# EAGLE design breakoutBoard_03 (EAGLE 7.2.0)
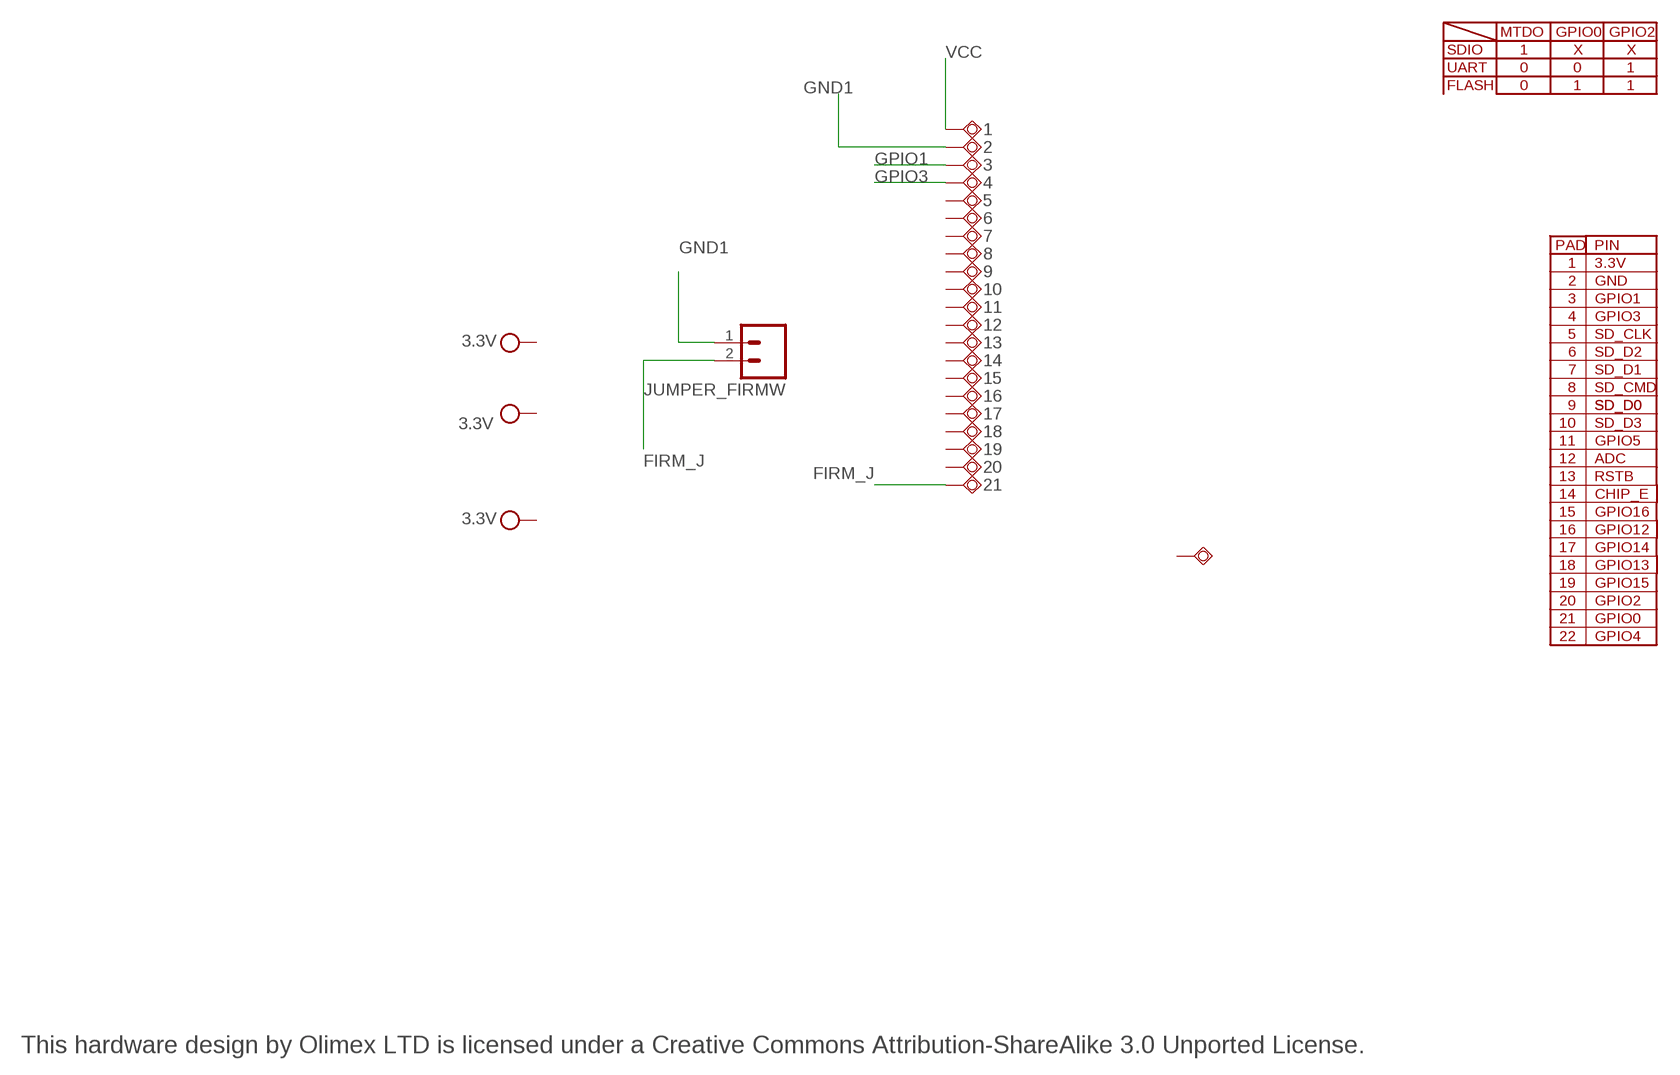
[diagram p0: schematic, sheet 1, part 1 of 2]
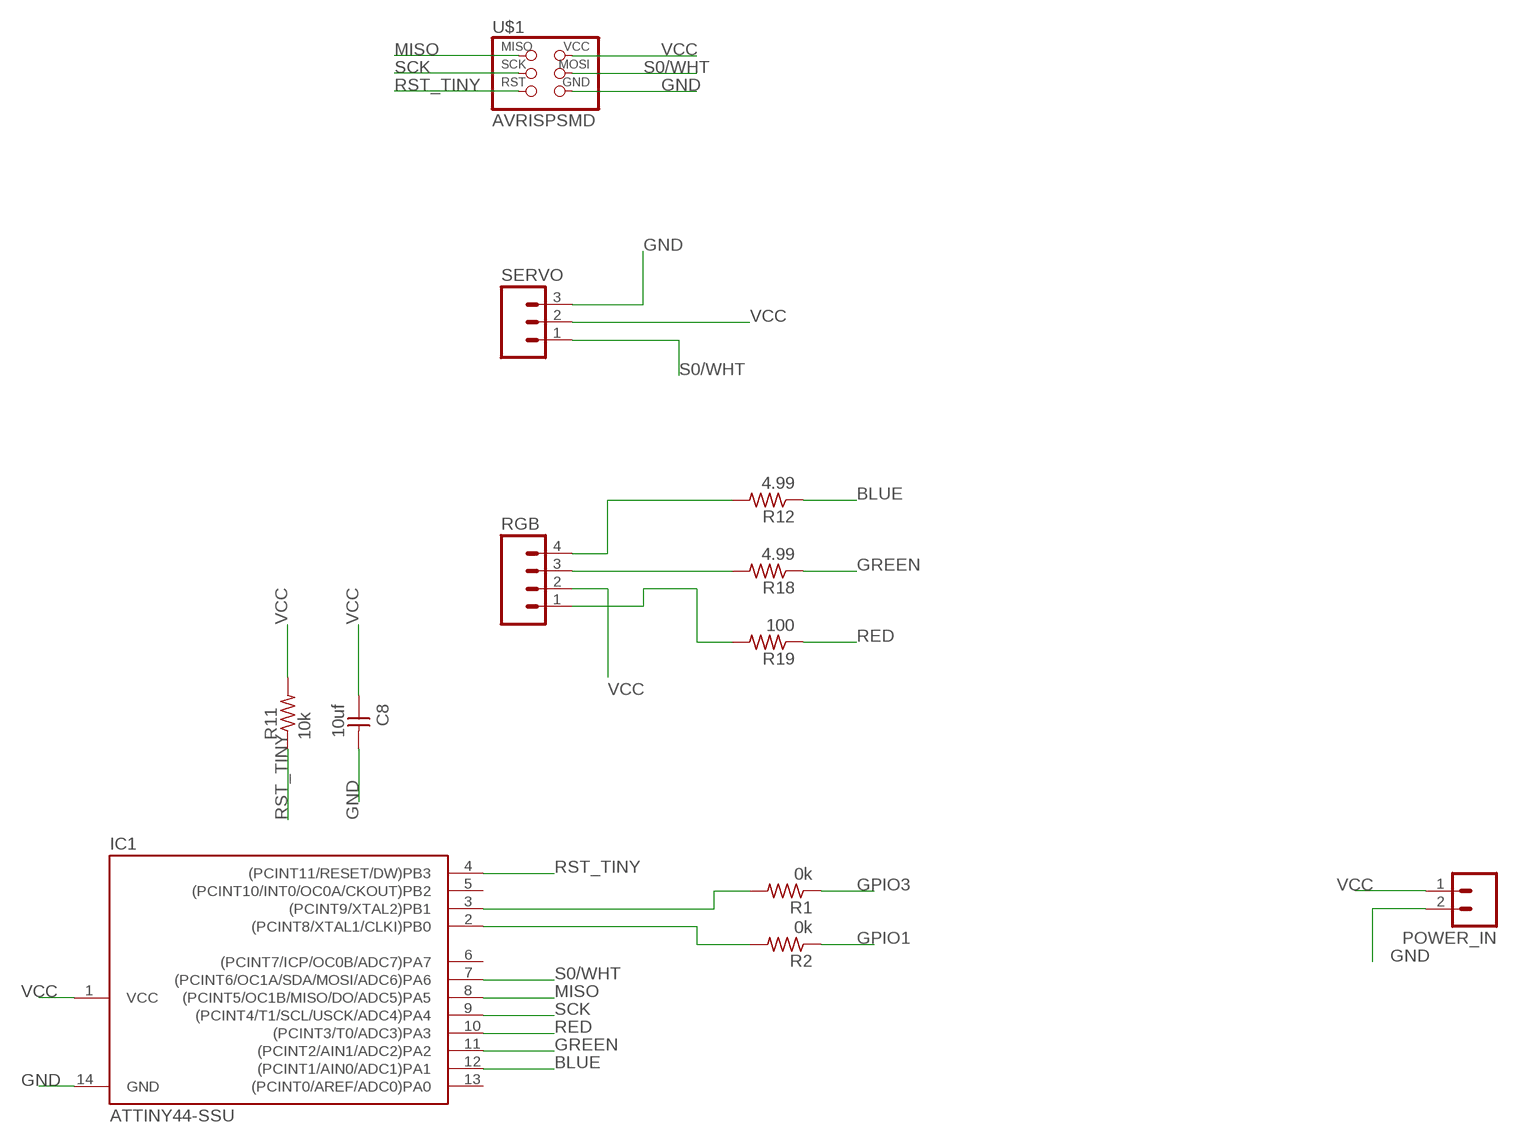
[diagram p1: schematic, sheet 1, part 2 of 2]

## Parts
1  TESTPAD8  [TESTPAD50/80]
2  TESTPAD8  [TESTPAD50/80]
3  TESTPAD8  [TESTPAD50/80]
4  TESTPAD8  [TESTPAD50/80]
5  TESTPAD8  [TESTPAD50/80]
6  TESTPAD8  [TESTPAD50/80]
7  TESTPAD8  [TESTPAD50/80]
8  TESTPAD8  [TESTPAD50/80]
9  TESTPAD8  [TESTPAD50/80]
10  TESTPAD8  [TESTPAD50/80]
11  TESTPAD8  [TESTPAD50/80]
12  TESTPAD8  [TESTPAD50/80]
13  TESTPAD8  [TESTPAD50/80]
14  TESTPAD8  [TESTPAD50/80]
15  TESTPAD8  [TESTPAD50/80]
16  TESTPAD8  [TESTPAD50/80]
17  TESTPAD8  [TESTPAD50/80]
18  TESTPAD8  [TESTPAD50/80]
19  TESTPAD8  [TESTPAD50/80]
20  TESTPAD8  [TESTPAD50/80]
21  TESTPAD8  [TESTPAD50/80]
22  TESTPAD8  [TESTPAD50/80]
C8  10uf  UNPOLARIZED_CAPACITOR1206  [1206]
IC1  ATTINY44-SSU  [SOIC14]
JUMPER_FIRMW  M02LOCK_LONGPADS  [1X02_LOCK_LONGPADS]
POWER_IN  M02LOCK_LONGPADS  [1X02_LOCK_LONGPADS]
R1  0k  RESISTOR1206  [1206]
R2  0k  RESISTOR1206  [1206]
R11  10k  RESISTOR1206  [1206]
R12  4.99  RESISTOR1206  [1206]
R18  4.99  RESISTOR1206  [1206]
R19  100  RESISTOR1206  [1206]
RGB  M04LONGPADS  [1X04_LONGPADS]
SERVO  M03LOCK_LONGPADS  [1X03_LOCK_LONGPADS]
U$1  AVRISPSMD  [2X03SMD]

## Nets
BLUE: IC1.12((PCINT1/AIN0/ADC1)PA1) R12.1
FIRM_J: 21.P$1(PP) JUMPER_FIRMW.2
GND: C8.2 IC1.14(GND) POWER_IN.2 SERVO.3 U$1.6(GND)
GND1: 2.P$1(PP) JUMPER_FIRMW.1
GPIO1: 3.P$1(PP) R2.1
GPIO3: 4.P$1(PP) R1.1
GREEN: IC1.11((PCINT2/AIN1/ADC2)PA2) R18.1
MISO: IC1.8((PCINT5/OC1B/MISO/DO/ADC5)PA5) U$1.1(MISO)
N$1: IC1.3((PCINT9/XTAL2)PB1) R1.2
N$2: IC1.2((PCINT8/XTAL1/CLKI)PB0) R2.2
N$20: R12.2 RGB.4
N$24: R18.2 RGB.3
N$25: R19.2 RGB.1
RED: IC1.10((PCINT3/T0/ADC3)PA3) R19.1
RST_TINY: IC1.4((PCINT11/RESET/DW)PB3) R11.1 U$1.5(RST)
S0/WHT: IC1.7((PCINT6/OC1A/SDA/MOSI/ADC6)PA6) SERVO.1 U$1.4(MOSI)
SCK: IC1.9((PCINT4/T1/SCL/USCK/ADC4)PA4) U$1.3(SCK)
VCC: 1.P$1(PP) C8.1 IC1.1(VCC) POWER_IN.1 R11.2 RGB.2 SERVO.2 U$1.2(VCC)
Unconnected: 5.P$1(PP) 6.P$1(PP) 7.P$1(PP) 8.P$1(PP) 9.P$1(PP) 10.P$1(PP) 11.P$1(PP) 12.P$1(PP) 13.P$1(PP) 14.P$1(PP) 15.P$1(PP) 16.P$1(PP) 17.P$1(PP) 18.P$1(PP) 19.P$1(PP) 20.P$1(PP) 22.P$1(PP) IC1.5((PCINT10/INT0/OC0A/CKOUT)PB2) IC1.6((PCINT7/ICP/OC0B/ADC7)PA7) IC1.13((PCINT0/AREF/ADC0)PA0)

## Notes on the sheet
- MTDO | GPIO0 | GPIO2
- SDIO | 1 | X | X
- UART | 0 | 0 | 1
- FLASH | 0 | 1 | 1
- PAD | PIN
- 1 | 3.3V
- 2 | GND
- 3 | GPIO1
- 4 | GPIO3
- 5 | SD_CLK
- 6 | SD_D2
- 7 | SD_D1
- 8 | SD_CMD
- 9 | SD_D0 | SD_D0
- 10 | SD_D3
- 11 | GPIO5
- 12 | ADC
- 13 | RSTB
- 14 | CHIP_E
- 15 | GPIO16
- 16 | GPIO12
- 17 | GPIO14
- 18 | GPIO13
- 19 | GPIO15
- 20 | GPIO2
- 21 | GPIO0
- 22 | GPIO4
- This hardware design by Olimex LTD is licensed under a Creative Commons Attribution-ShareAlike 3.0 Unported License.

## Library data of the parts
1-22 = gogo:TESTPAD: drill 40mils, diameter 70mils
C8 = 01_FAB_RHello:UNPOLARIZED_CAPACITOR: unpolarized_capacitor
IC1 = 01_FAB_RHello:ATTINY44
JUMPER_FIRMW POWER_IN = SparkFun-Connectors:M02: Standard 2-pin 0.1" header. Use with - straight break away headers ( PRT-00116) - right angle break away headers (PRT-00553) - swiss pins (PRT-00743) - machine pins (PRT-00117) - female headers (PRT-00115) Molex polarized connector foot print use with: PRT-08233 with associated crimp pins and housings. 2.54_SCREWTERM for use with PRT-10571. 3.5mm Screw Terminal footprints for PRT-08084 5mm Screw Terminal footprints for use with PRT-08432
R1 R2 R11 R12 R18 R19 = 01_FAB_RHello:RESISTOR
RGB = SparkFun-Connectors:M04: Header 4 Standard 4-pin 0.1" header. Use with straight break away headers (SKU : PRT-00116), right angle break away headers (PRT-00553), swiss pins (PRT-00743), machine pins (PRT-00117), and female headers (PRT-00115). Molex polarized connector foot print use with SKU : PRT-08231 with associated crimp pins and housings. 1MM SMD Version SKU: PRT-10208
SERVO = SparkFun-Connectors:M03: Header 3 Standard 3-pin 0.1" header. Use with straight break away headers (SKU : PRT-00116), right angle break away headers (PRT-00553), swiss pins (PRT-00743), machine pins (PRT-00117), and female headers (PRT-00115). Molex polarized connector foot print use with SKU : PRT-08232 with associated crimp pins and housings.
U$1 = 01_FAB_RHello:AVRISP

## Board
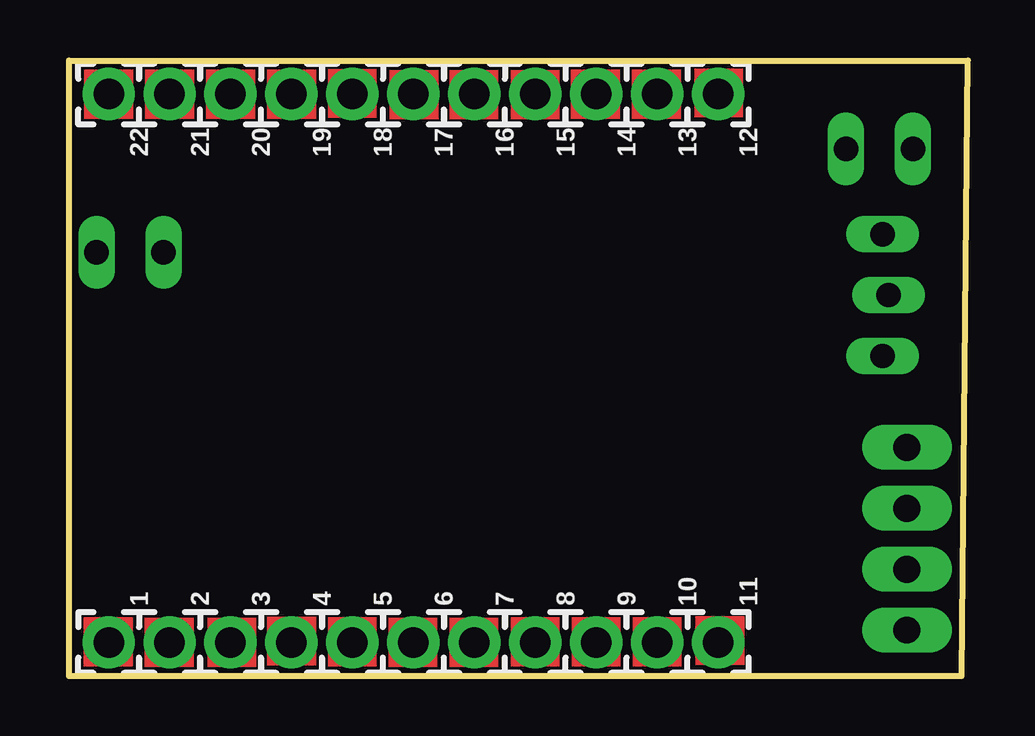
[diagram p2: board, top side]
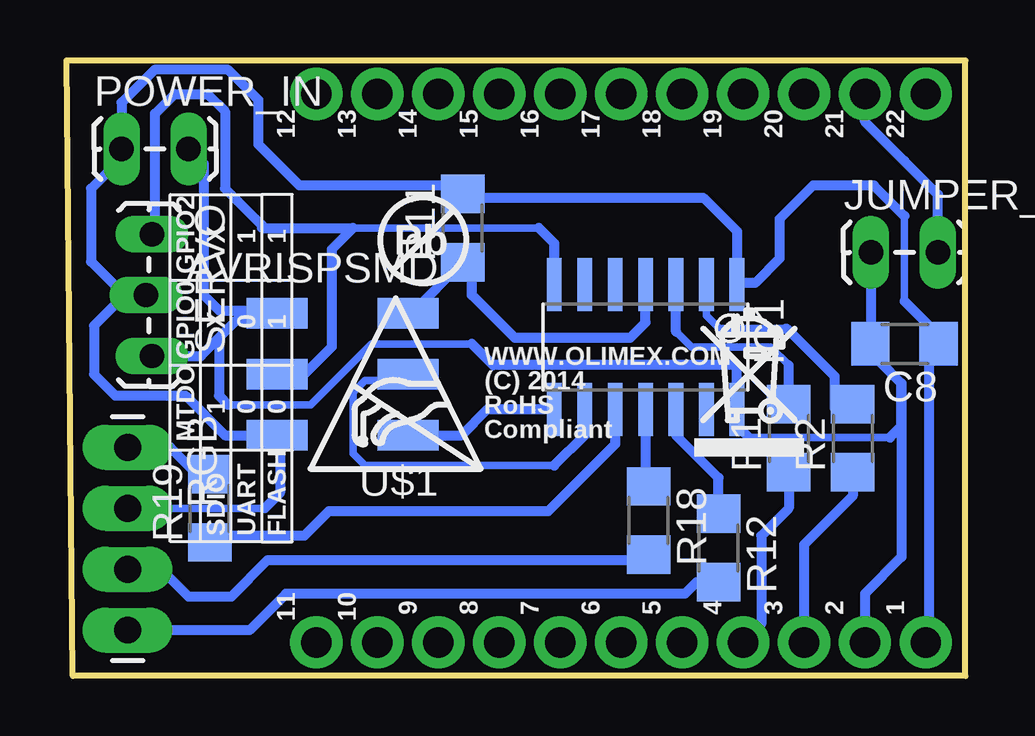
[diagram p3: board, bottom side, seen from below]

Size 37.47 x 25.65 mm. Coordinates in mm from the lower left corner, seen from the top.
Outline: 37.21,0 37.47,25.65 0,25.65 0,0 37.21,0
Copper layers (1+16): Top 0.035mm / dielectric 1.5mm / Bottom 0.035mm
Design rules "default": minimum track width 5mil, minimum drill 0.3mm, track to track 5mil, track to pad 5mil, pad to pad 5mil, via to via 5mil, smd to smd 1mil, copper to edge 5mil, drill to drill 8mil, minimum pad ring 6mil, minimum via ring 6mil, stop-mask expansion 2mil, vias tented up to drill 25mil, thermal gap 10mil
tRestrict: 94 lines
bRestrict: 99 lines

### Footprints (pad centres in the part's own frame; a part is rotated, then mirrored left to right if it is on the bottom)
TESTPAD50/80 = drill 1.27 pad 2.184: P$1 0,0
1206 = smd 1.6 x 1.803: 1 -1.422,0; 2 1.422,0
SOIC14 = smd 0.61 x 2.21: 1 -3.81,-2.603; 2 -2.54,-2.603; 3 -1.27,-2.603; 4 0,-2.603; 5 1.27,-2.603; 6 2.54,-2.603; 7 3.81,-2.603; 8 3.81,2.603; 9 2.54,2.603; 10 1.27,2.603; 11 0,2.603; 12 -1.27,2.603; 13 -2.54,2.603; 14 -3.81,2.603
1X02_LOCK_LONGPADS = drill 1.016 long: 1 -0.127,0; 2 2.667,0
1X04_LONGPADS = drill 1.118 pad 1.88 long: 1 0,0; 2 2.54,0; 3 5.08,0; 4 7.62,0
1X03_LOCK_LONGPADS = drill 1.016 long: 1 0,0; 2 2.54,-0.254; 3 5.08,0
2X03SMD = smd 2.54 x 1.27: 1 -2.54,2.54; 2 2.92,2.54; 3 -2.54,0; 4 2.92,0; 5 -2.54,-2.54; 6 2.92,-2.54

### Placement (x,y rotation side)
1  1.65,1.4 0 top
2  4.19,1.4 0 top
3  6.73,1.4 0 top
4  9.27,1.4 0 top
5  11.81,1.4 180 top
6  14.35,1.4 180 top
7  16.89,1.4 180 top
8  19.43,1.4 180 top
9  21.97,1.4 180 top
10  24.51,1.4 180 top
11  27.05,1.4 0 top
12  27.05,24.26 0 top
13  24.51,24.26 0 top
14  21.97,24.26 0 top
15  19.43,24.26 0 top
16  16.89,24.26 180 top
17  14.35,24.26 0 top
18  11.81,24.26 180 top
19  9.27,24.26 0 top
20  6.73,24.26 180 top
21  4.19,24.26 180 top
22  1.65,24.26 180 top
C8  2.54,13.84 180 bottom
IC1  13.34,13.72 180 bottom
JUMPER_FIRMW  3.81,17.65 0 bottom
POWER_IN  35.05,21.97 0 bottom
R1  7.37,9.91 90 bottom
R2  4.7,9.91 90 bottom
R11  20.96,18.67 90 bottom
R12  10.29,5.33 270 bottom
R18  13.21,6.48 270 bottom
R19  31.5,6.98 90 bottom
RGB  34.92,9.53 270 bottom
SERVO  33.91,18.41 270 bottom
U$1  25.78,12.57 180 bottom
U$4  [ESD_SYMBOL]  27.3,8.64 0 bottom
U$6  [PB_SMALL]  22.61,18.16 180 bottom
U$7  [RECYCLE_BIN1/8]  11.3,9.14 0 bottom

### Tracks (layer width: path | path; a pad name or v marks a point on that pad's centre or on a via)
BLUE
  Bottom 0.406: R12.1 10.29,8.26 12.06,10.03 IC1.12
FIRM_J
  Bottom 0.406: JUMPER_FIRMW.2 1.14,20.07 2.54,21.46 4.19,23.11 21.P$1
GND
  Bottom 0.305: 9.02,9.93 3.15,9.93 | 30.73,11.3 27.3,11.3 24.77,13.84 20.57,13.84
  Bottom 0.406: 3.94,13.87 C8.2 3.56,13.44 3.56,13.08 2.67,12.19 2.67,10.41 3.15,9.93 | 9.02,9.93 9.53,10.44 IC1.14 9.53,12.83 9.65,12.95 19.68,12.95 20.57,13.84 | 31.12,14.1 30.35,14.86 28.45,14.86 U$1.6 28.7,15.24 31.12,15.24 31.75,15.88 31.75,21.34 POWER_IN.2 | 31.12,14.1 31.12,11.68 30.73,11.3 | SERVO.3 31.88,13.34 31.12,14.1
GND1
  Bottom 0.406: JUMPER_FIRMW.1 3.94,13.46 2.67,12.19 2.67,4.95 4.19,3.43 2.P$1
GPIO1
  Bottom 0.406: R2.1 4.7,7.49 6.73,5.46 3.P$1
GPIO3
  Bottom 0.406: R1.1 7.37,6.98 8.51,5.84 8.51,2.16 4.P$1
GREEN
  Bottom 0.406: IC1.11 13.34,8.03 R18.1
MISO
  Bottom 0.406: U$1.1 21.01,10.03 19.91,11.12 17.16,11.12 IC1.8
N$1
  Bottom 0.305: 7.37,12.95 8.13,13.72 11.43,13.72 12.06,14.35
  Bottom 0.406: R1.2 7.37,12.95 | 12.06,14.35 IC1.3
N$2
  Bottom 0.305: IC1.2 10.79,15.02 10.26,14.48 7.49,14.48
  Bottom 0.406: 4.7,11.94 R2.2 4.7,11.18 5.46,11.18 5.46,12.49 7.45,14.48 7.49,14.48
N$20
  Bottom 0.406: R12.2 11.2,3.91 11.68,3.43 28.32,3.43 29.84,1.91 RGB.4
N$24
  Bottom 0.406: R18.2 13.44,4.83 29.08,4.83 30.61,3.3 32.38,3.3 33.53,4.45 RGB.3
N$25
  Bottom 0.406: R19.2 32.03,8.41 33.15,9.53 RGB.1
RED
  Bottom 0.406: IC1.10 14.61,9.65 17.4,6.86 26.54,6.86 27.56,5.84 31.22,5.84 R19.1
RST_TINY
  Bottom 0.406: 21.23,17.53 R11.1 | R11.1 20.96,16.89 | IC1.4 13.34,14.73 13.97,14.1 18.8,14.1 20.57,15.88 20.57,16.87 R11.1 | U$1.5 23.09,15.11 R11.1
S0/WHT
  Bottom 0.305: 25.53,18.67 17.78,18.67
  Bottom 0.406: 27.43,12.7 26.42,13.72 26.42,17.78 25.53,18.67 29.34,18.67 29.34,18.8 30.86,20.32 30.86,23.54 31.58,24.26 32.97,24.26 33.78,23.44 33.78,18.41 SERVO.1 | 27.43,12.7 28.57,12.7 U$1.4 27.56,12.57 27.43,12.7 | 17.78,18.67 17.14,18.03 IC1.7
SCK
  Bottom 0.305: 23.5,12.32 25.02,12.32 25.53,11.81 25.53,9.27 25.02,8.76 17.14,8.76
  Bottom 0.406: IC1.9 15.88,10.03 17.14,8.76 | 23.5,12.32 U$1.3
VCC
  Bottom 0.305: 2.54,15.62 2.54,19.18 | 29.21,6.98 RGB.2
  Bottom 0.406: 1.52,13.74 C8.1 1.14,13.87 | 21.11,19.94 R11.2 | 1.52,13.74 1.52,1.52 1.P$1 | 1.52,13.74 1.52,14.61 2.54,15.62 | 2.54,19.18 3.81,20.45 6.35,20.45 7.75,19.05 7.75,17.4 8.76,16.38 9.46,16.38 IC1.1 9.53,18.54 10.92,19.94 20.8,19.94 R11.2 | R11.2 21.31,20.45 27.75,20.45 29.46,22.16 29.46,24 30.73,25.27 33.8,25.27 35.18,23.9 POWER_IN.1 35.18,21.59 36.45,20.32 36.45,17.27 35.05,15.88 | SERVO.2 35.05,15.88 | 35.05,15.88 36.32,14.61 36.32,12.57 35.43,11.68 32.51,11.68 30.86,10.03 U$1.2 28.57,10.03 28.57,7.62 29.21,6.98
(copper drawn outside any net)
  shapes: Top area x22

### Text on the board
bPlace: 1 | 1 | X | GPIO2 | 1 | 0 | X | GPIO0 | 0 | 0 | 1 | MTDO | FLASH | UART | SDIO
bNames: WWW.OLIMEX.COM | (C) 2014 | RoHS | Compliant
201bmp: C:/YASSEN_ON_C-YASSEN-REBORN/TASKS/MOD-nRF8001===P/Nordic_NRF8001/nRF8001-Gerber Files/with DCDC/\!PICLIST-0909+++.BMP